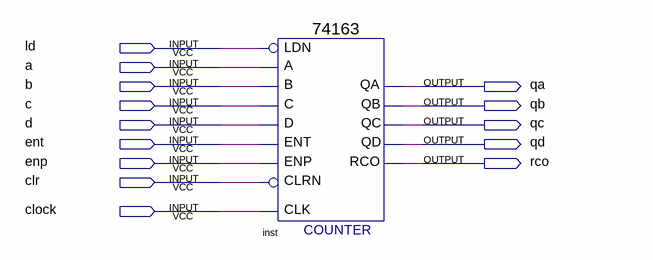
[diagram p0: schematic sheet]
// Quartus schematic contador_74163.bdf as structural Verilog: 1 symbols, 14 pins
module contador_74163 (
  input  ld,
  input  a,
  input  b,
  input  c,
  input  d,
  input  ent,
  input  enp,
  input  clr,
  input  clock,
  output qa,
  output qb,
  output qc,
  output qd,
  output rco
);

  \74163  inst (
    .C(c), .B(b), .A(a), .ENT(ent), .D(d), .CLRN(clr), .CLK(clock), .ENP(enp), .LDN(ld), .QA(qa), .QB(qb),
    .QC(qc), .QD(qd), .RCO(rco));
endmodule
